# EAGLE design Regulator (EAGLE 8.0.0)
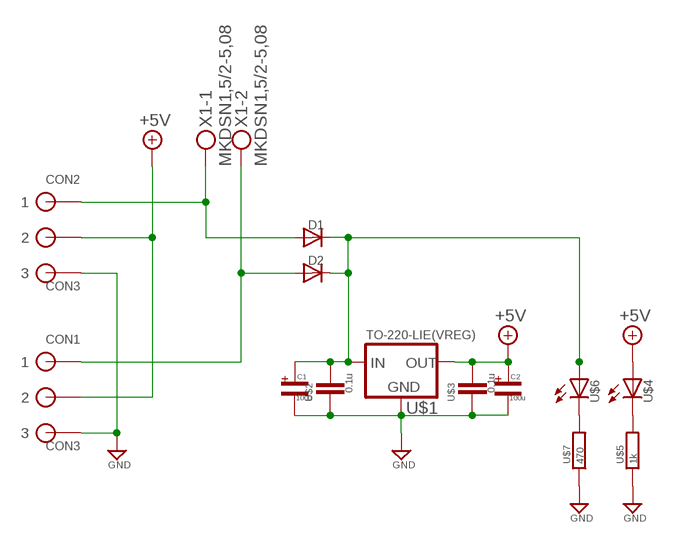
[diagram p0: schematic, sheet 1]

## Parts
C1  100u  コンデンサ(電解)E2.5-5  [D=1,φ=5]
C2  100u  コンデンサ(電解)E2.5-5  [D=1,φ=5]
CON1  CON3  [CON3]
CON2  CON3  [CON3]
D1  (汎用)D=3  [DO41(D=3)]
D2  (汎用)D=3  [DO41(D=3)]
U$1  TO-220-LIE(VREG)  [TO-220(LIE)]
U$2  0.1u  コンデンサ0805  [0805]
U$3  0.1u  コンデンサ0805  [0805]
U$4  LED(砲弾型)3  [LED3MM]
U$5  1k  抵抗0805  [0805]
U$6  LED(砲弾型)3  [LED3MM]
U$7  470  抵抗0805  [0805]
X1  MKDSN1,5/2-5,08  [MKDSN1,5/2-5,08]

## Nets
+5V: C2.+ CON1.P$2 CON2.P$2 U$1.3(OUT) U$3.1 U$4.A
+9V: C1.+ D1.C D2.C U$1.1(IN) U$2.1 U$6.A
GND: C1.- C2.- CON1.P$3 CON2.P$3 U$1.2(GND) U$2.2 U$3.2 U$5.1 U$7.1
N$1: CON2.P$1 D1.A X1.1
N$2: CON1.P$1 D2.A X1.2
N$3: U$4.K U$5.2
N$5: U$6.K U$7.2

## Library data of the parts
C1 C2 = (Foundation)電解コンデンサ:コンデンサ(電解): POLARIZED CAPACITOR, European symbol
CON1 CON2 = (コネクタ)XH:CON3: low insertion CON
D1 D2 = (半導体)ダイオード:(汎用): DIODE general purpose rectifier, 1 A
U$1 = (半導体)FET＆トランジスタ:TO-220-LIE(VREG)
U$2 U$3 = (Foundation)表面実装RC:コンデンサ
U$4 U$6 = (半導体)LED:LED(砲弾型)
U$5 U$7 = (Foundation)表面実装RC:抵抗
X1 = con-phoenix-508:MKDSN1,5/2-5,08: MKDSN 1,5/ 2-5,08 Printklemme Nennstrom: 13,5 A Nennspannung: 250 V Rastermaß: 5,08 mm Polzahl: 2 Anschlussart: Schraubanschluss Montage: Löten Anschlussrichtung Leiter/Platine: 0 ° Artikelnummer: 1729128 Source: http://eshop.phoenixcontact.com .. 1729128.pdf

## Board
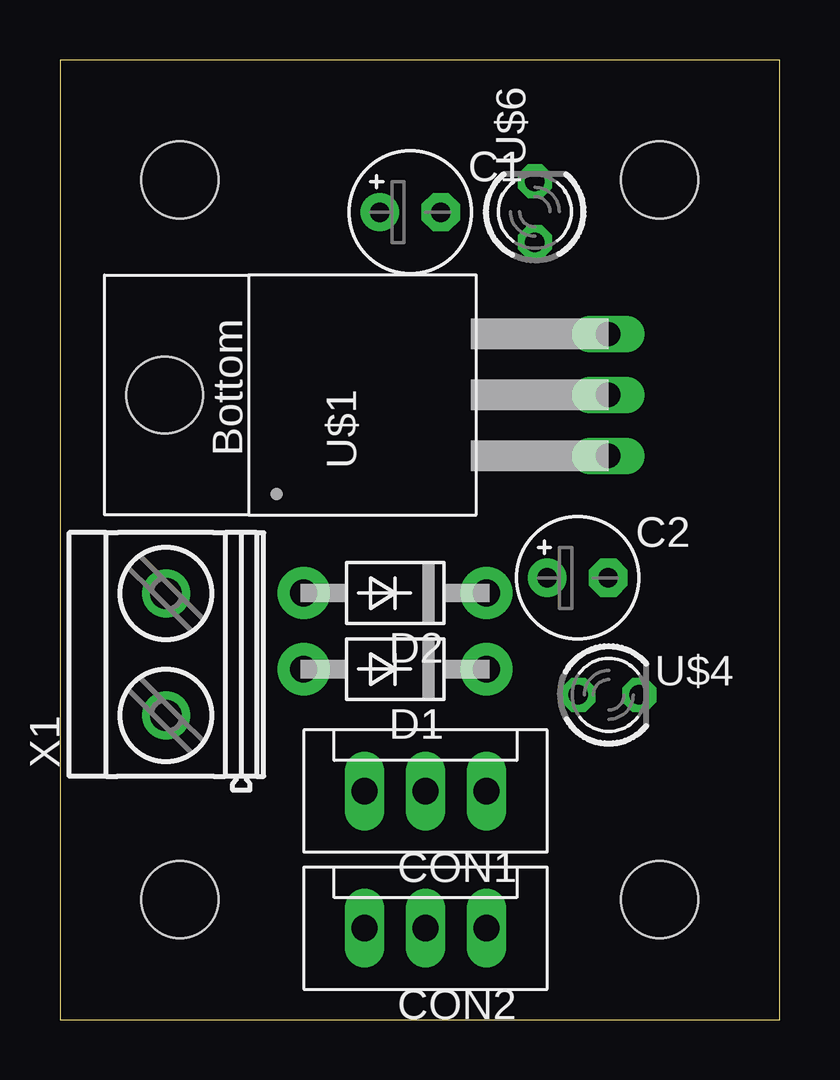
[diagram p1: board, top side]
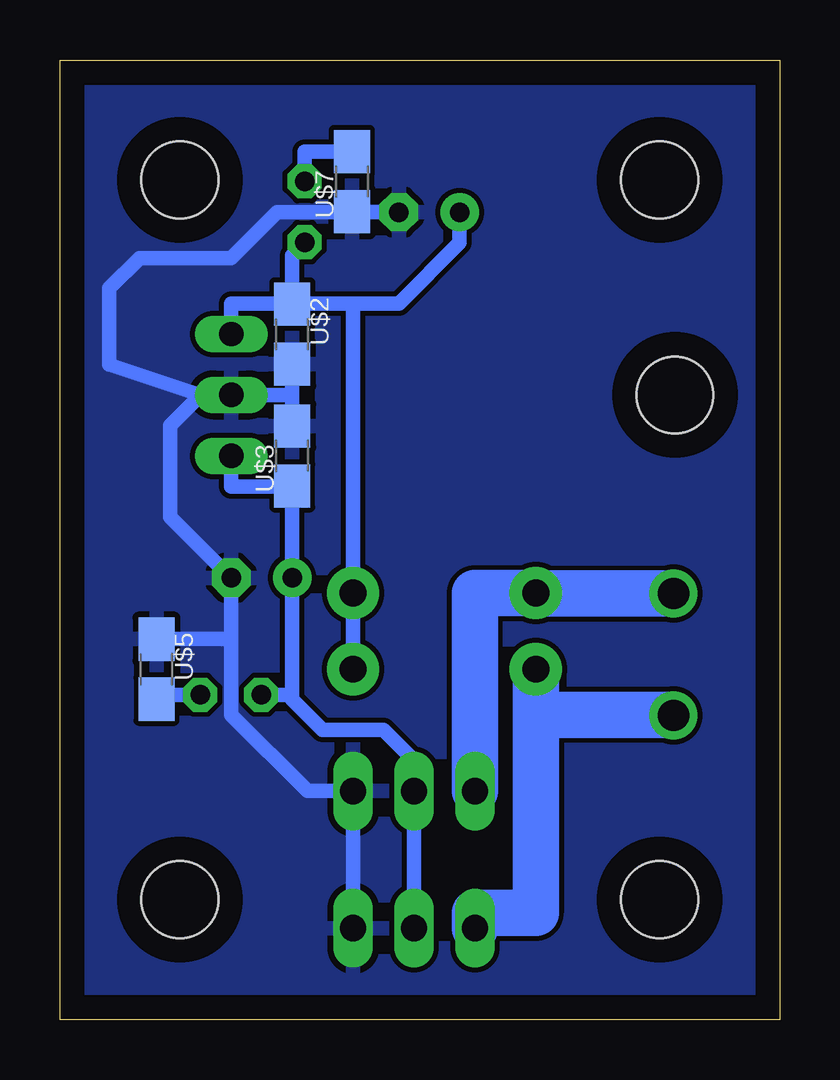
[diagram p2: board, bottom side, seen from below]

Size 30 x 40 mm. Coordinates in mm from the lower left corner, seen from the top.
Outline: 0,0 30,0 30,40 0,40 0,0
Copper layers (1*16): Top 0.035mm / dielectric 1.5mm / Bottom 0.035mm
Design rules "default": minimum track width 10mil, minimum drill 24mil, track to track 8mil, track to pad 8mil, pad to pad 8mil, via to via 8mil, smd to smd 8mil, copper to edge 40mil, drill to drill 8mil, minimum pad ring 10mil, minimum via ring 8mil, stop-mask expansion 4mil, vias tented up to drill 0mil, thermal gap 10mil
Holes 3.2 mm at 5,5 25,5 25,35 5,35

### Footprints (pad centres in the part's own frame; a part is rotated, then mirrored left to right if it is on the bottom)
D=1,φ=5 = drill 0.813 pad 1.6: + -1.27,0 | drill 0.813 pad 1.6 octagon: - 1.27,0
CON3 = drill 1.1 long: P$1 2.54,0; P$2 0,0; P$3 -2.54,0
DO41(D=3) = drill 1.118 pad 2.184: A 3.81,0; C -3.81,0
TO-220(LIE) = drill 1.016 long: 1 2.54,0; 2 0,0; 3 -2.54,0 | hole 3.2: 0,18.5
0805 = smd 1.8 x 1.5: 1 -1.25,0; 2 1.25,0
LED3MM = drill 0.813 pad 1.422 octagon: A -1.27,0; K 1.27,0
MKDSN1,5/2-5,08 = drill 1.3 pad 2: 1 -2.561,0.025; 2 2.519,0.025

### Placement (x,y rotation side)
C1  14.61,33.66 0 top
C2  21.59,18.41 0 top
CON1  15.24,9.53 180 top
CON2  15.24,3.81 180 top
D1  13.97,14.61 180 top
D2  13.97,17.78 180 top
U$1  22.86,26.04 90 top
U$2  20.32,28.57 270 bottom
U$3  20.32,23.5 90 bottom
U$4  22.88,13.54 0 top
U$5  25.98,14.61 270 bottom
U$6  19.8,33.67 90 top
U$7  17.82,34.92 90 bottom
X1  4.45,15.24 90 top

### Tracks (layer width: path | path; a pad name or v marks a point on that pad's centre or on a via)
+5V
  Bottom 0.61: CON2.P$2 CON1.P$2 15.24,10.79 16.51,12.06 19.05,12.06 20.32,13.34 20.32,13.54 | U$1.3 22.86,22.23 20.55,22.23 U$3.1 C2.+ 20.32,13.54 | U$4.A 20.32,13.54
+9V
  Bottom 0.61: D2.C D1.C 17.78,29.84 | U$1.1 22.86,29.84 20.55,29.84 U$2.1 | C1.+ 13.34,32.38 15.88,29.84 17.78,29.84 | 17.78,29.84 20.09,29.84 U$2.1 | U$6.A 20.32,31.85 U$2.1
GND
  Bottom 0.61: CON2.P$3 CON1.P$3 19.68,9.53 22.86,12.7 22.86,15.86 | 24.13,26.04 U$1.2 20.32,26.04 | 24.13,26.04 25.4,24.77 25.4,20.95 C2.- 22.86,15.86 | 20.32,26.04 U$2.2 | 20.32,26.04 U$3.2 | C1.- 20.95,33.66 22.86,31.75 26.67,31.75 27.94,30.48 27.94,27.3 24.13,26.04 | U$5.1 22.86,15.86
  pour Bottom: 0,0 0,40 30,40 30,0
N$1
  Bottom 1.93: CON2.P$1 12.7,4.45 10.16,4.45 10.16,12.7 | 10.16,12.7 D1.A | X1.1 4.42,12.7 10.16,12.7
N$2
  Bottom 1.93: CON1.P$1 12.7,17.78 D2.A 10.16,17.76 X1.2
N$3
  Bottom 0.61: U$4.K 25.68,13.54 U$5.2
N$5
  Bottom 0.61: U$6.K 19.8,36.17 U$7.2